# Altium schematic sheet ZNXC.SchDoc
size A3
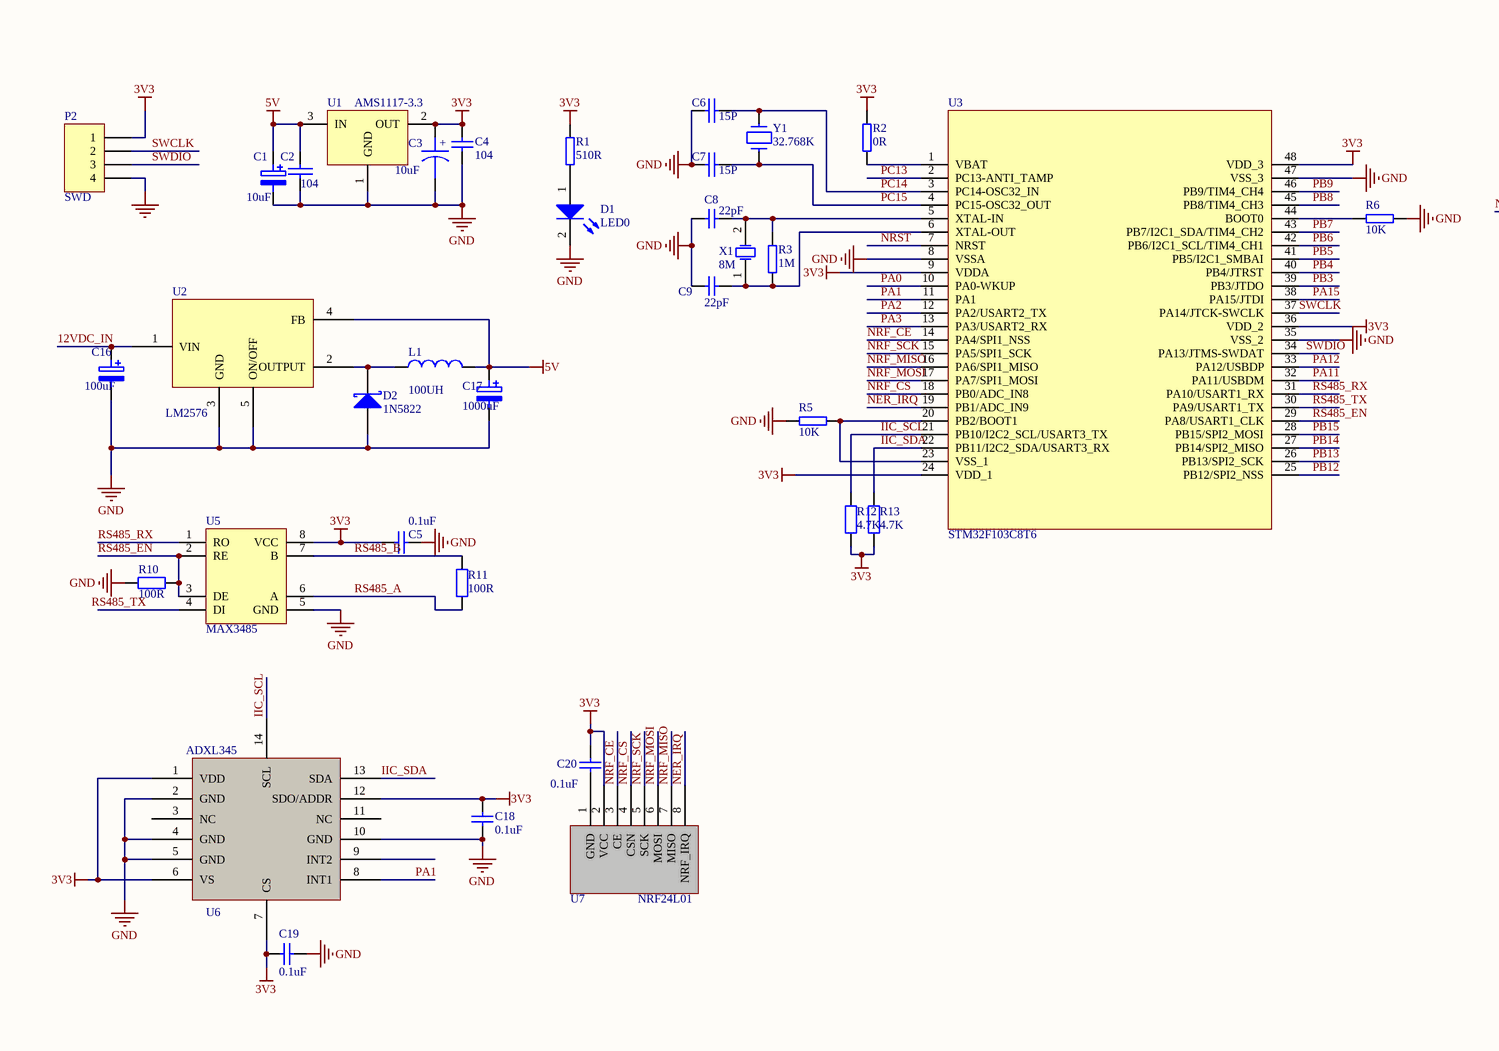
[diagram p0: ZNXC.SchDoc, left]
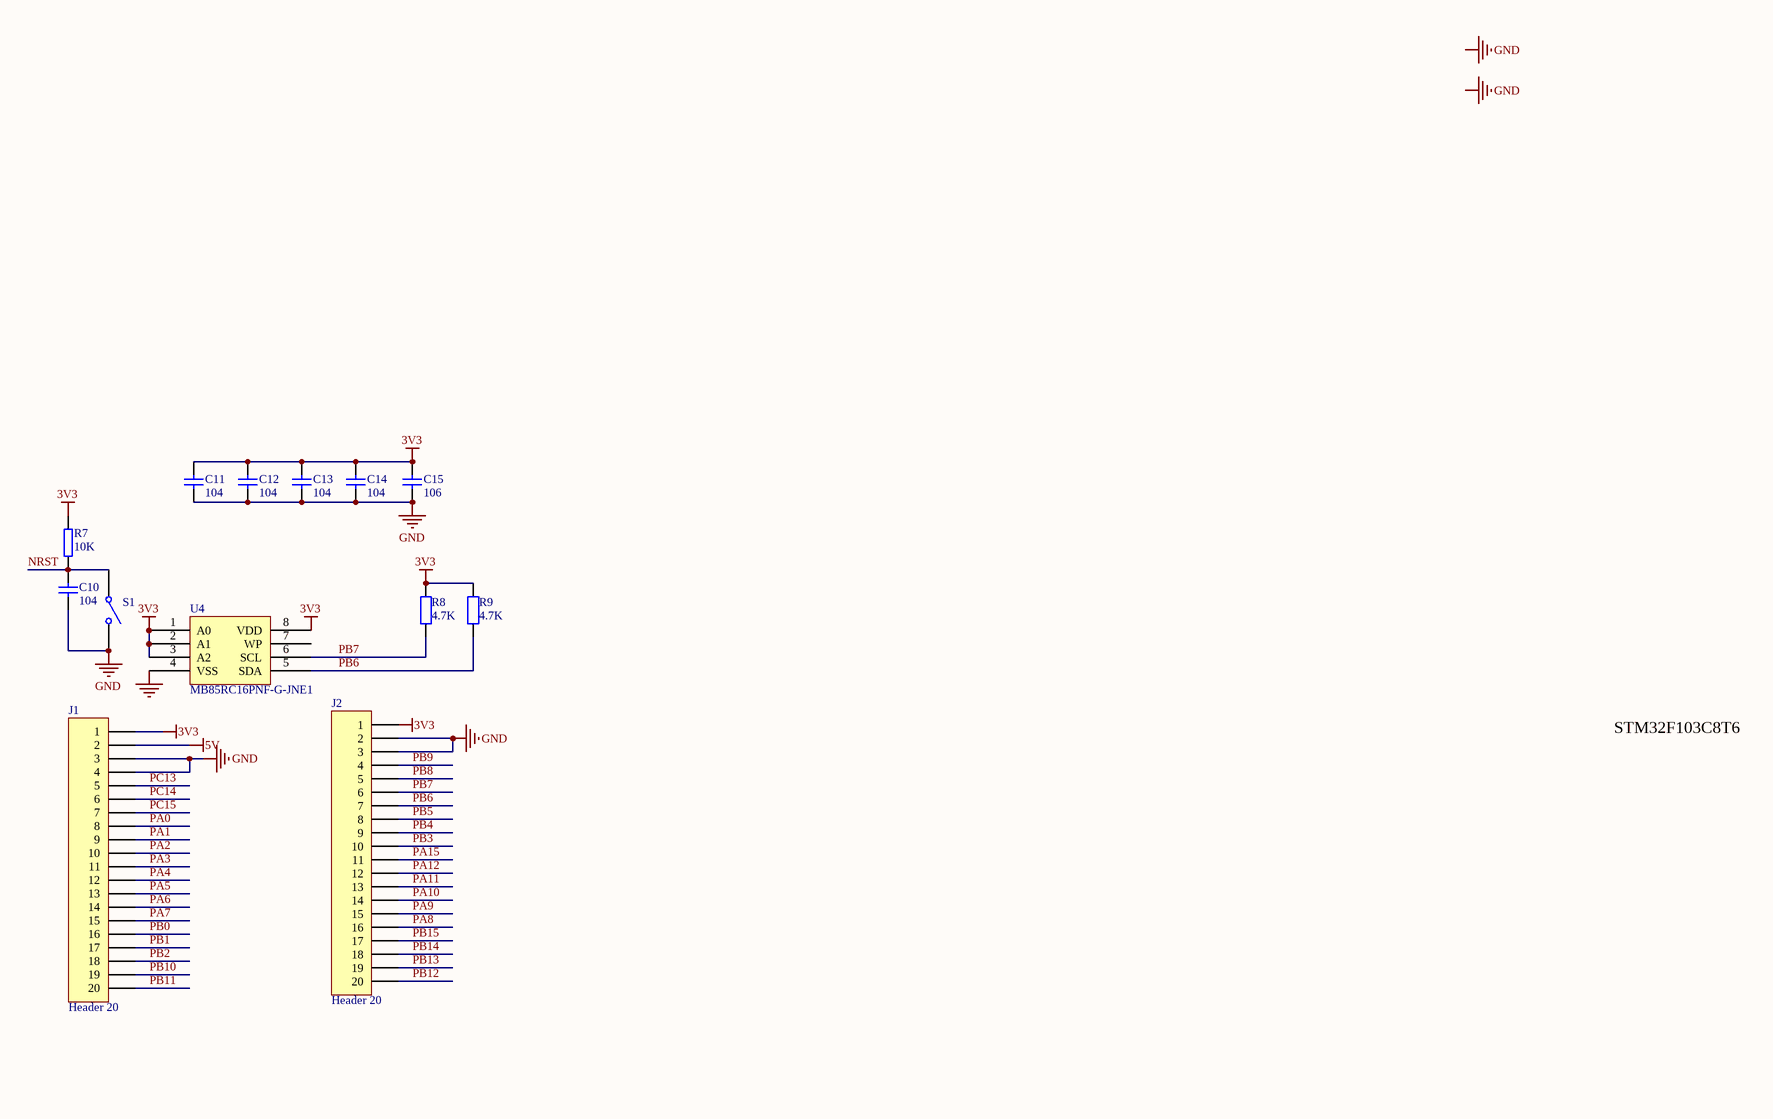
[diagram p1: ZNXC.SchDoc, right]

## Parts
C1  10uF  [RC0805]
C2  104  [RC0603]
C3  10uF  [RC0805]
C4  104  [RC0603]
C5  value 0.1uF  [C0603]  (hidden comment: 无源贴片电容)
C6  15P  [RC0603]
C7  15P  [RC0603]
C8  22pF  [RC0603]
C9  22pF  [RC0603]
C10  104  [RC0603]
C11  104  [RC0603]
C12  104  [RC0603]
C13  104  [RC0603]
C14  104  [RC0603]
C15  106  [RC0805]
C16  100uF  [RC0805]
C17  1000uF  [RC0805]
C18  value 0.1uF  [C0603]  (hidden comment: 无源贴片电容)
C19  value 0.1uF  [C0603]  (hidden comment: 无源贴片电容)
C20  value 0.1uF  [C0603]  (hidden comment: 无源贴片电容)
D1  LED0  [LED0805]
D2  1N5822  [DO-204AL]
J1  Header 20  [HDR1X20]
J2  Header 20  [HDR1X20]
L1  value 100UH  [0402-A]  (hidden comment: Inductor)
P2  SWD  [XH2.54-4P]
R1  510R  [RC0603]
R2  0R  [RC0603]
R3  1M  [RC0603]
R5  10K  [RC0603]
R6  10K  [RC0603]
R7  10K  [RC0603]
R8  4.7K  [R0603]
R9  4.7K  [R0603]
R10  value 100R  [R0603]  (hidden comment: 贴片电阻 1%)
R11  value 100R  [R0603]  (hidden comment: 贴片电阻 1%)
R12  4.7K  [R0603]
R13  4.7K  [R0603]
S1  SW-SPST  [SMT-KEY]  (value not drawn)
U1  AMS1117-3.3  [SOT223]
U2  LM2576
U3  STM32F103C8T6  [LQFP48]
U4  MB85RC16PNF-G-JNE1  [SO-8]
U5  MAX3485  [SO-8]
U6  ADXL345
U7  NRF24L01
X1  8M  [SMD49S]
Y1  32.768K  [JZ32768]

## Nets
3V3: C3.1 C4.1 C5.1 C11.1 C12.1 C13.1 C14.1 C15.1 C18.1 C19.2 C20.1 J1.1 J2.1 P2.1 R1.2 R2.2 R7.2 R8.2 R9.2 R12.1 R13.2 U1.2(OUT) U3.9(VDDA) U3.24(VDD_1) U3.36(VDD_2) U3.48(VDD_3) U4.1(A0) U4.2(A1) U4.3(A2) U4.8(VDD) U5.8(VCC) U6.1(VDD) U6.6(VS) U6.7(CS) U6.12(SDO/ADDR) U7.2(VCC)
5V: C1.1 C2.1 C17.1 J1.2 L1.2 U1.3(IN) U2.4(FB)
GND: C1.2 C2.2 C3.2 C4.2 C5.2 C6.1 C7.1 C8.2 C9.2 C10.2 C11.2 C12.2 C13.2 C14.2 C15.2 C16.2 C17.2 C18.2 C19.1 D1.2(K) D2.1(A) J1.3 J1.4 J2.2 J2.3 P2.4 R5.2 R6.1 R10.1 S1.2(NO) U1.1(GND) U2.3(GND) U2.5(ON/OFF) U3.8(VSSA) U3.35(VSS_2) U3.47(VSS_3) U4.4(VSS) U5.5(GND) U6.2(GND) U6.4(GND) U6.5(GND) U6.10(GND)
12VDC_IN: C16.1 U2.1(VIN)
IIC_SCL: R12.2 U3.21(PB10/I2C2_SCL/USART3_TX) U6.14(SCL)
IIC_SDA: R13.1 U3.22(PB11/I2C2_SDA/USART3_RX) U6.13(SDA)
NER_IRQ: U3.19(PB1/ADC_IN9) U7.8(NRF_IRQ)
NRF_CE: U3.14(PA4/SPI1_NSS) U7.3(CE)
NRF_CS: U3.18(PB0/ADC_IN8) U7.4(CSN)
NRF_MISO: U3.16(PA6/SPI1_MISO) U7.7(MISO)
NRF_MOSI: U3.17(PA7/SPI1_MOSI) U7.6(MOSI)
NRF_SCK: U3.15(PA5/SPI1_SCK) U7.5(SCK)
NRST: C10.1 R7.1 S1.1(COMMON) U3.7(NRST)
PA0: J1.8 U3.10(PA0-WKUP)
PA1: J1.9 U3.11(PA1) U6.8(INT1)
PA2: J1.10 U3.12(PA2/USART2_TX)
PA3: J1.11 U3.13(PA3/USART2_RX)
PA4: J1.12
PA5: J1.13
PA6: J1.14
PA7: J1.15
PA8: J2.16
PA9: J2.15
PA10: J2.14
PA11: J2.13 U3.32(PA11/USBDM)
PA12: J2.12 U3.33(PA12/USBDP)
PA15: J2.11 U3.38(PA15/JTDI)
PB0: J1.16
PB1: J1.17
PB2: J1.18
PB3: J2.10 U3.39(PB3/JTDO)
PB4: J2.9 U3.40(PB4/JTRST)
PB5: J2.8 U3.41(PB5/I2C1_SMBAI)
PB6: J2.7 R9.1 U3.42(PB6/I2C1_SCL/TIM4_CH1) U4.5(SDA)
PB7: J2.6 R8.1 U3.43(PB7/I2C1_SDA/TIM4_CH2) U4.6(SCL)
PB8: J2.5 U3.45(PB8/TIM4_CH3)
PB9: J2.4 U3.46(PB9/TIM4_CH4)
PB10: J1.19
PB11: J1.20
PB12: J2.20 U3.25(PB12/SPI2_NSS)
PB13: J2.19 U3.26(PB13/SPI2_SCK)
PB14: J2.18 U3.27(PB14/SPI2_MISO)
PB15: J2.17 U3.28(PB15/SPI2_MOSI)
PC13: J1.5 U3.2(PC13-ANTI_TAMP)
PC14: C6.2 J1.6 U3.3(PC14-OSC32_IN) Y1.2
PC15: C7.2 J1.7 U3.4(PC15-OSC32_OUT) Y1.1
RS485_A: R11.1 U5.6(A)
RS485_B: R11.2 U5.7(B)
RS485_EN: R10.2 U3.29(PA8/USART1_CLK) U5.2(RE) U5.3(DE)
RS485_RX: U3.31(PA10/USART1_RX) U5.1(RO)
RS485_TX: U3.30(PA9/USART1_TX)
SWCLK: P2.2 U3.37(PA14/JTCK-SWCLK)
SWDIO: P2.3 U3.34(PA13/JTMS-SWDAT)
NetC8_1: C8.1 R3.2 U3.5(XTAL-IN) X1.2
NetC9_1: C9.1 R3.1 U3.6(XTAL-OUT) X1.1
NetC20_2: C20.2 U7.1(GND)
NetD1_1: D1.1(A) R1.1
NetD2_2: D2.2(K) L1.1 U2.2(OUTPUT)
NetR2_1: R2.1 U3.1(VBAT)
NetR5_1: R5.1 U3.20(PB2/BOOT1) U3.23(VSS_1)
NetR6_2: R6.2 U3.44(BOOT0)

Not connected (* = marked no-connect by the designer): U4 7(WP); U5 4(DI); U6 3(NC) 9(INT2) 11(NC)

## Notes on the sheet
- STM32F103C8T6
- Labels drawn without touching a wire or pin: GND, RS485_TX
- (in symbol CAPACITOR POL) +

## Library data of the parts
C1 C16 C17 = ELECTRO2
C2 = CAP: Capacitor
C3 = CAPACITOR POL: Capacitor
C4 C5 C18-C20 = Cap: Capacitor; Published: 8-Jun-2000; LatestRevisionDate: 17-Jul-2002; LatestRevisionNote: Re-released for DXP Platform.; PackageReference: RAD-0.3; Publisher: Altium Limited
  C5 C18-C20: PackageDescription: Radial Cap, Thru-Hole; 2 Leads; 0.3 in Pin Spacing
C6 C7 = CAP
C8 C9 = CAP1: Capacitor; Tolerate: 50V; Value: 20pF; TOL: 2%; ERP: 0103020090; PCB_Layout: Top Layer SMC; Revision: 2012-3-28; Publisher: ZL_A0OFFICE
C10-C15 = CAP1: Capacitor; Tolerate: 50V; Value: 100nF; TOL: 10%; ERP: 0103020075; PCB_Layout: Top Layer SMC; Revision: 2012-3-28; Publisher: ZL_A0OFFICE
D1 = LED0: Typical INFRARED GaAs LED
D2 = Diode 11DQ03: Schottky Rectifier; Published: 8-Jun-2000; LatestRevisionDate: 17-Jul-2002; LatestRevisionNote: Re-released for DXP Platform.; DatasheetDocument: Dec-1997; PackageReference: DO-204AL; Publisher: Altium Limited; Code_JEDEC: DO-204-AL; ComponentLink1Description: Manufacturer Link; ComponentLink1URL: http://www.irf.com/; ComponentLink2Description: Datasheet; ComponentLink2URL: http://www.irf.com/product-info/datasheets/data/11dq03.pdf
J1 J2 = Header 20: Header, 20-Pin; LatestRevisionDate: 17-Jul-2002; LatestRevisionNote: Re-released for DXP Platform.; Publisher: Altium Limited
L1 = Inductor: Code_IEC: 1005; Published: 8-Jun-2000; LatestRevisionDate: 17-Jul-2002; LatestRevisionNote: Re-released for DXP Platform.; PackageReference: 0402-A; Publisher: Altium Limited; Code_JEITA: 0402
P2 = Header 4H: Header, 4-Pin, Right Angle; LatestRevisionDate: 17-Jul-2002; LatestRevisionNote: Re-released for DXP Platform.; Publisher: Altium Limited
R1-R3 R5-R7 = R
R8 R9 R12 R13 = Res2: 贴片电阻 精度1%; Published: 8-Jun-2000; LatestRevisionDate: 17-Jul-2002; LatestRevisionNote: Re-released for DXP Platform.; PackageReference: AXIAL-0.4; Publisher: Altium Limited; PackageDescription: Axial Device, Thru-Hole; 2 Leads; 0.4 in Pin Spacing; Value: 4.7K
R10 R11 = Res2: Resistor; Published: 8-Jun-2000; LatestRevisionDate: 17-Jul-2002; LatestRevisionNote: Re-released for DXP Platform.; PackageReference: AXIAL-0.4; Publisher: Altium Limited; PackageDescription: Axial Device, Thru-Hole; 2 Leads; 0.4 in Pin Spacing
S1 = SW-SPST: Single-Pole, Single-Throw Switch
U1 = LT1085CM-3.3
U4 = MB85RC16PNF-G-JNE1: EEPROM存储
U5 = SP3485: 485总线芯片
X1 = XTAL_SMD: Crystal Oscillator; ERP: 0103040021; Value: 8MHz; TOL: ±20ppm; Tolerate: ROSON -20_+70 20pf; PCB_Layout: Top Layer SMC; Publisher: ZL_A0OFFICE; Revision: 2012-3-28
Y1 = CRYSTAL: 晶振